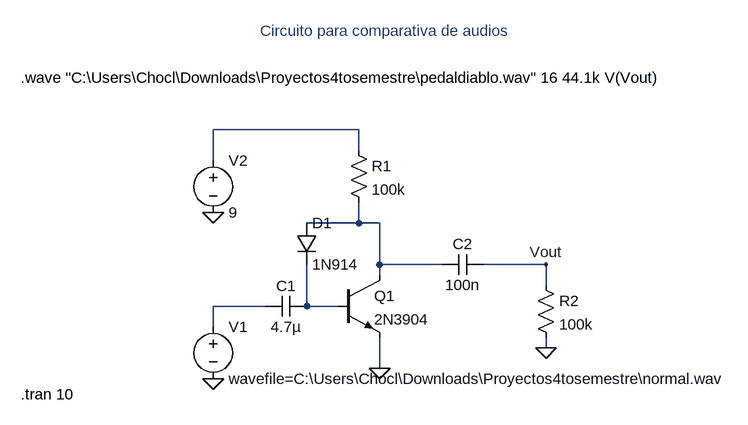
[diagram p0: schematic Simulacion pedal fuzz PARA PRUEBAS.asc]
Simulacion pedal fuzz PARA PRUEBAS.asc, the LTspice schematic file:
Version 4
SHEET 1 880 680
WIRE 208 -208 -16 -208
WIRE 208 -176 208 -208
WIRE -16 -160 -16 -208
WIRE 208 -64 208 -96
WIRE 208 -64 128 -64
WIRE 240 -64 208 -64
WIRE 240 0 240 -64
WIRE 336 0 240 0
WIRE 496 0 400 0
WIRE 240 16 240 0
WIRE 496 32 496 0
WIRE 64 64 -16 64
WIRE 128 64 128 0
WIRE 176 64 128 64
WIRE -16 96 -16 64
WIRE 496 128 496 112
WIRE 240 160 240 112
FLAG -16 176 0
FLAG 240 160 0
FLAG -16 -80 0
FLAG 496 128 0
FLAG 496 0 Vout
SYMBOL voltage -16 80 R0
SYMATTR InstName V1
SYMATTR Value wavefile=C:\Users\Chocl\Downloads\Proyectos4tosemestre\normal.wav
SYMBOL cap 64 80 R270
WINDOW 0 32 32 VTop 2
WINDOW 3 0 32 VBottom 2
SYMATTR InstName C1
SYMATTR Value 4.7µ
SYMBOL npn 176 16 R0
SYMATTR InstName Q1
SYMATTR Value 2N3904
SYMBOL voltage -16 -176 R0
SYMATTR InstName V2
SYMATTR Value 9
SYMBOL res 192 -192 R0
SYMATTR InstName R1
SYMATTR Value 100k
SYMBOL cap 336 16 R270
WINDOW 0 32 32 VTop 2
WINDOW 3 0 32 VBottom 2
SYMATTR InstName C2
SYMATTR Value 100n
SYMBOL diode 112 -64 R0
SYMATTR InstName D1
SYMATTR Value 1N914
SYMBOL res 480 16 R0
SYMATTR InstName R2
SYMATTR Value 100k
TEXT -312 -288 Left 2 !.wave "C:\\Users\\Chocl\\Downloads\\Proyectos4tosemestre\\pedaldiablo.wav" 16 44.1k V(Vout)
TEXT -312 200 Left 2 !.tran 10
TEXT 56 -360 Left 2 ;Circuito para comparativa de audios

The netlist it stands for:
* Simulacion pedal fuzz PARA PRUEBAS.asc
V1 N003 0 wavefile=C:\Users\Chocl\Downloads\Proyectos4tosemestre\normal.wav
C1 N003 N004 4.7µ
Q1 N002 N004 0 0 2N3904
V2 N001 0 9
R1 N001 N002 100k
C2 N002 Vout 100n
D1 N002 N004 1N914
R2 Vout 0 100k
.model D D
.lib standard.dio
.model NPN NPN
.model PNP PNP
.lib standard.bjt
.wave "C:\Users\Chocl\Downloads\Proyectos4tosemestre\pedaldiablo.wav" 16 44.1k V(Vout)
.tran 10
* Circuito para comparativa de audios
.backanno
.end